# Altium schematic sheet connectors.SchDoc
size A4
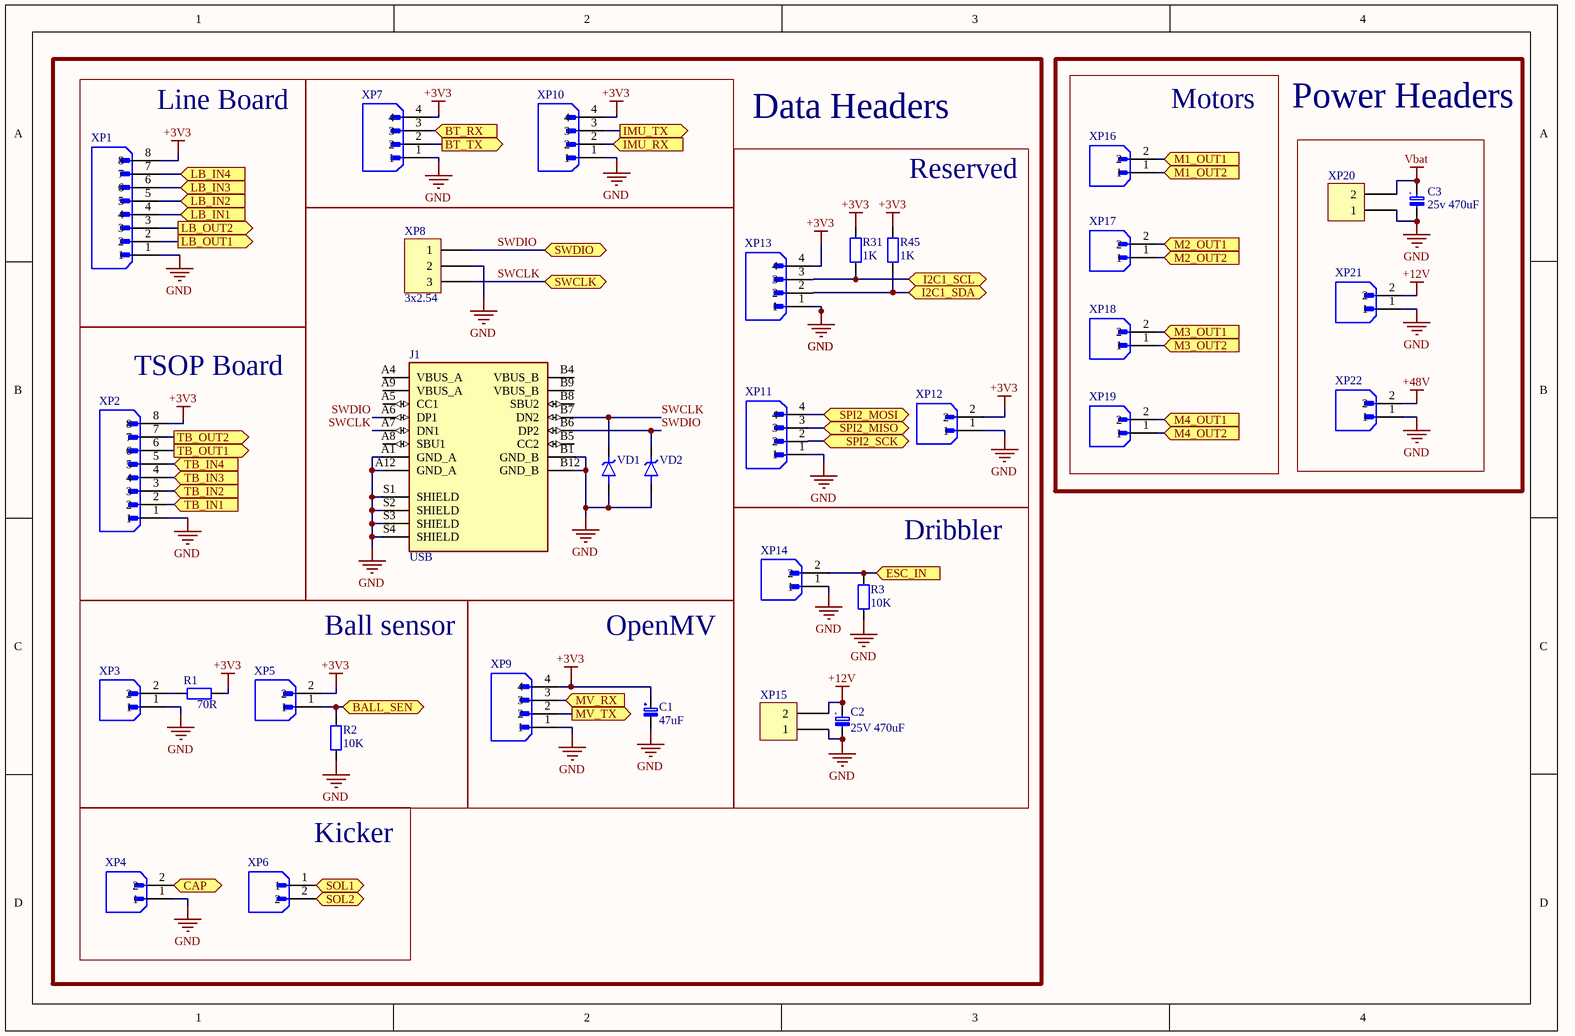
[diagram p0: connectors.SchDoc]

## Parts
C1  47uF  [CAP_TANT_D]
C2  25V 470uF  [D10C4.4H10]
C3  25v 470uF  [D10C4.4H10]
J1  USB  [USB-C VERTICAL]
R1  70R  [RES0805]
R2  10K  [RES0805]
R3  10K  [RES0805]
R31  1K  [RES0805]
R45  1K  [RES0805]
VD1  (no value)  [DO-214AC (SMA)]
VD2  (no value)  [DO-214AC (SMA)]
XP1  JST_B8B-XH-A(LF)(SN)  [JST_XH-8]  (value not drawn)
XP2  JST_B8B-XH-A(LF)(SN)  [JST_XH-8]  (value not drawn)
XP3  JST_B2B-XH-A(LF)(SN)  [JST_XH-2]  (value not drawn)
XP4  JST_B2B-XH-A(LF)(SN)  [JST_XH-2]  (value not drawn)
XP5  JST_B2B-XH-A(LF)(SN)  [JST_XH-2]  (value not drawn)
XP6  JST_B2B-XH-A(LF)(SN)  [JST_XH-2]  (value not drawn)
XP7  JST_B4B-XH-A(LF)(SN)  [JST_XH-4]  (value not drawn)
XP8  3x2.54  [3x2.54]
XP9  JST_B4B-XH-A(LF)(SN)  [JST_XH-4]  (value not drawn)
XP10  JST_B4B-XH-A(LF)(SN)  [JST_XH-4]  (value not drawn)
XP11  JST_B4B-XH-A(LF)(SN)  [JST_XH-4 (clear)]  (value not drawn)
XP12  JST_B2B-XH-A(LF)(SN)  [JST_XH-2]  (value not drawn)
XP13  JST_B4B-XH-A(LF)(SN)  [JST_XH-4]  (value not drawn)
XP14  JST_B2B-XH-A(LF)(SN)  [JST_XH-2]  (value not drawn)
XP15  XT30  [XT30_3D]  (value not drawn)
XP16  JST_B2B-XH-A(LF)(SN)  [JST_XH-2]  (value not drawn)
XP17  JST_B2B-XH-A(LF)(SN)  [JST_XH-2]  (value not drawn)
XP18  JST_B2B-XH-A(LF)(SN)  [JST_XH-2]  (value not drawn)
XP19  JST_B2B-XH-A(LF)(SN)  [JST_XH-2]  (value not drawn)
XP20  XT30  [XT30_3D]  (value not drawn)
XP21  JST_B2B-XH-A(LF)(SN)  [JST_XH-2]  (value not drawn)
XP22  JST_B2B-XH-A(LF)(SN)  [JST_XH-2]  (value not drawn)

## Blocks framed on the sheet
Data Headers: J1 VD1 VD2 XP7 XP8 XP10
Line Board: XP1
Power Headers: C3 XP20-XP22
Motors: XP16-XP19
Reserved: R31 R45 XP11-XP13
TSOP Board: XP2
Dribbler: C2 R3 XP14 XP15
Ball sensor: R1 R2 XP3 XP5
OpenMV: C1 XP9
Kicker: XP4 XP6

## Ports
BALL_SEN (bidir), BT_RX (in), BT_TX (out), CAP (bidir), ESC_IN (in), I2C1_SCL (bidir), I2C1_SDA (bidir), IMU_RX (in), IMU_TX (out), LB_IN1 (in), LB_IN2 (in), LB_IN3 (in), LB_IN4 (in), LB_OUT1 (out), LB_OUT2 (out), M1_OUT1 (in), M1_OUT2 (in), M2_OUT1 (in), M2_OUT2 (in), M3_OUT1 (in), M3_OUT2 (in), M4_OUT1 (in), M4_OUT2 (in), MV_RX (in), MV_TX (out), SOL1 (bidir), SOL2 (bidir), SPI2_MISO (bidir), SPI2_MOSI (bidir), SPI2_SCK (bidir), SWCLK (bidir), SWDIO (bidir), TB_IN1 (in), TB_IN2 (in), TB_IN3 (in), TB_IN4 (in), TB_OUT1 (out), TB_OUT2 (out)

## Nets
+3V3: C1.2 R1.2 R31.1 R45.1 XP1.8 XP2.8 XP5.2 XP7.4 XP9.4 XP10.4 XP12.2 XP13.4
+12V: C2.1(PLUS) XP15.2 XP21.2
+48V: XP22.2
GND: C1.1 C2.2(MINUS) C3.2(MINUS) J1.A1(GND_A) J1.A12(GND_A) J1.B1(GND_B) J1.B12(GND_B) J1.S1(SHIELD) J1.S2(SHIELD) J1.S3(SHIELD) J1.S4(SHIELD) R2.1 R3.1 VD1.A VD2.A XP1.1 XP2.1 XP3.1 XP4.1 XP7.1 XP8.2 XP9.1 XP10.1 XP11.1 XP12.1 XP13.1 XP14.1 XP15.1 XP20.1 XP21.1 XP22.1
Vbat: C3.1(PLUS) XP20.2
BALL_SEN: R2.2 XP5.1 ; port BALL_SEN
BT_RX: XP7.3 ; port BT_RX
BT_TX: XP7.2 ; port BT_TX
CAP: XP4.2 ; port CAP
ESC_IN: R3.2 XP14.2 ; port ESC_IN
I2C1_SCL: R31.2 XP13.3 ; port I2C1_SCL
I2C1_SDA: R45.2 XP13.2 ; port I2C1_SDA
IMU_RX: XP10.2 ; port IMU_RX
IMU_TX: XP10.3 ; port IMU_TX
LB_IN1: XP1.4 ; port LB_IN1
LB_IN2: XP1.5 ; port LB_IN2
LB_IN3: XP1.6 ; port LB_IN3
LB_IN4: XP1.7 ; port LB_IN4
LB_OUT1: XP1.2 ; port LB_OUT1
LB_OUT2: XP1.3 ; port LB_OUT2
M1_OUT1: XP16.2 ; port M1_OUT1
M1_OUT2: XP16.1 ; port M1_OUT2
M2_OUT1: XP17.2 ; port M2_OUT1
M2_OUT2: XP17.1 ; port M2_OUT2
M3_OUT1: XP18.2 ; port M3_OUT1
M3_OUT2: XP18.1 ; port M3_OUT2
M4_OUT1: XP19.2 ; port M4_OUT1
M4_OUT2: XP19.1 ; port M4_OUT2
MV_RX: XP9.3 ; port MV_RX
MV_TX: XP9.2 ; port MV_TX
SOL1: XP6.1 ; port SOL1
SOL2: XP6.2 ; port SOL2
SPI2_MISO: XP11.3 ; port SPI2_MISO
SPI2_MOSI: XP11.4 ; port SPI2_MOSI
SPI2_SCK: XP11.2 ; port SPI2_SCK
SWCLK: J1.A7(DN1) J1.B7(DN2) VD1.K XP8.3 ; port SWCLK
SWDIO: J1.A6(DP1) J1.B6(DP2) VD2.K XP8.1 ; port SWDIO
TB_IN1: XP2.2 ; port TB_IN1
TB_IN2: XP2.3 ; port TB_IN2
TB_IN3: XP2.4 ; port TB_IN3
TB_IN4: XP2.5 ; port TB_IN4
TB_OUT1: XP2.6 ; port TB_OUT1
TB_OUT2: XP2.7 ; port TB_OUT2
NetR1_1: R1.1 XP3.2

Not connected (* = marked no-connect by the designer): J1 A4(VBUS_A) A5(CC1) A8(SBU1) A9(VBUS_A) B4(VBUS_B) B5(CC2) B8(SBU2) B9(VBUS_B)

## Notes on the sheet
- (in symbol Cap Aluminum) +

## Library data of the parts
C1 = CAP Tantal: Tantal SMD Cap
C2 C3 = Cap Aluminum: Electrolytic Cap; ComponentLink1Description: Chipdip; ComponentLink1URL: https://www.chipdip.ru/product0/9000565743
J1 = USB-C: SWD port
R1-R3 R31 R45 = RES: RES smd
VD1 VD2 = Diode TVS
XP1 = JST-XH-8: Line Board
XP2 = JST-XH-8: TSOP Board
XP3 = JST-XH-2: BALL_LED
XP4 = JST-XH-2: CAP
XP5 = JST-XH-2: BALL_SEN
XP6 = JST-XH-2: Solenoid
XP7 = JST_XH-4: HC-05
XP8 = Header 3: SWD header
XP9 = JST_XH-4: OpenMV
XP10 = JST_XH-4: IMU
XP11 = JST_XH-4: SPI
XP12 = JST-XH-2: +3V3
XP13 = JST_XH-4: I2C
XP14 = JST-XH-2: ESC_IN
XP15 = Power connectors: ESC_PWR
XP16 = JST-XH-2: M1
XP17 = JST-XH-2: M2
XP18 = JST-XH-2: M3
XP19 = JST-XH-2: M4
XP20 = Power connectors: BAT
XP21 = JST-XH-2: XL6009 IN
XP22 = JST-XH-2: XL6009 OUT